# Altium schematic sheet COMS0006_SwC_Flow_Diagram.SchDoc: Switching Circuit Signal Flow
size A3; Engineer: D. JEDRYCHOWSKI; Organization: BLUEsat Project; Address1: Room 419; Address2: School of EE&T; Address3: UNSW, NSW 2052; Address4: Australia; DocumentNumber: COMS0006; SheetNumber: 1; SheetTotal: 1; Version: 1.0
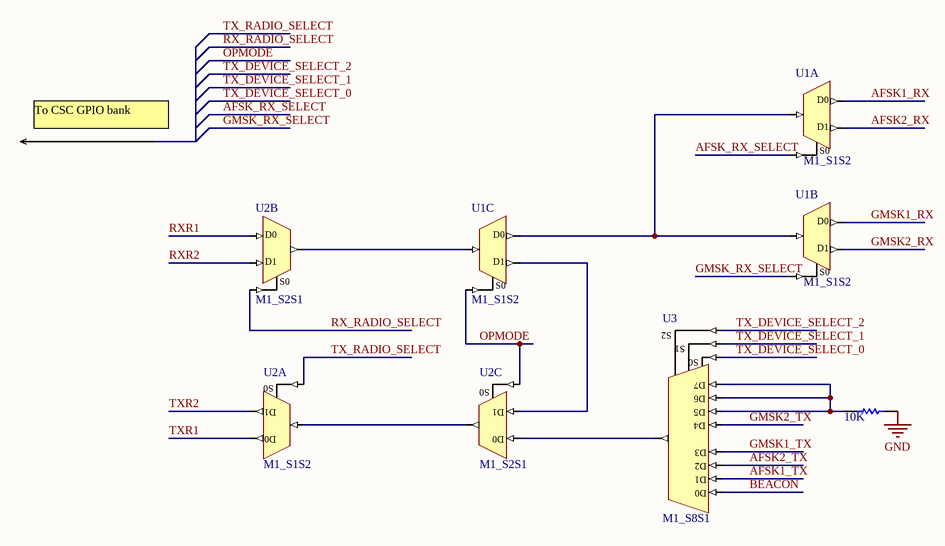
[diagram p0: COMS0006_SwC_Flow_Diagram.SchDoc]

## Parts
R?  value 10K  [AXIAL-0.3]  (hidden comment: Res1)
U1A  M1_S1S2
U1B  M1_S1S2
U1C  M1_S1S2
U2A  M1_S1S2
U2B  M1_S2S1
U2C  M1_S2S1
U3  M1_S8S1

## Nets
GND: R?.2
AFSK1_RX: U1A.D0
AFSK1_TX: U3.D1
AFSK2_RX: U1A.D1
AFSK2_TX: U3.D2
AFSK_RX_SELECT: U1A.S0
BEACON: U3.D0
GMSK1_RX: U1B.D0
GMSK1_TX: U3.D3
GMSK2_RX: U1B.D1
GMSK2_TX: U3.D4
GMSK_RX_SELECT: U1B.S0
OPMODE: U1C.S0 U2C.S0
RX_RADIO_SELECT: U2B.S0
RXR1: U2B.D0
RXR2: U2B.D1
TX_DEVICE_SELECT_0: U3.S0
TX_DEVICE_SELECT_1: U3.S1
TX_DEVICE_SELECT_2: U3.S2
TX_RADIO_SELECT: U2A.S0
TXR1: U2A.D0
TXR2: U2A.D1
NetR?_1: R?.1 U3.D5 U3.D6 U3.D7
NetU1A_O: U1A.O U1B.O U1C.D0
NetU1C_D1: U1C.D1 U2C.D1
NetU1C_O: U1C.O U2B.O
NetU2A_O: U2A.O U2C.O
NetU2C_D0: U2C.D0 U3.O

## Notes on the sheet
- To CSC GPIO bank
- Title
- Description:
- Size:
- Author:
- Date:
- A3
- Time:
- Version
- Sheet:
- Drawing No.:
- of
- File:

## Library data of the parts
R? = Res1: Resistor; Published: 8-Jun-2000; LatestRevisionDate: 17-Jul-2002; LatestRevisionNote: Re-released for DXP Platform.; PackageReference: AXIAL-0.3; Publisher: Altium Limited; PackageDescription: Axial Device, Thru-Hole; 2 Leads; 0.3 in Pin Spacing
U1A U1B U1C U2A = M1_S1S2: 1x1-Single Wire to 2x1-Single Wire Multiplexer (Demultiplex); SubClass: S1Sn; PortSize: 1; PortStyle: Single Pin Version; ArchiveName: GENERIC; VHDLIB_SIM: GENERIC_LIB; Published: 29-Jan-2004; Publisher: Altium Limited; LastRevisionNo: 1.00.00; HelpURL: CR0118 FPGA Generic Library Guide.pdf#page=328; ComponentLink1URL: CR0137 FPGA Multiplexer Resource Usage.pdf#page=36; ComponentLink1Description: Core &Resource Usage; FunctionalClass: Multiplexer
U2B U2C = M1_S2S1: 2x1-Single Wire to 1x1-Single Wire Multiplexer; XilinxEquivalent: M2_1; SubClass: SnS1; PortSize: 1; PortStyle: Single Pin Version; ArchiveName: GENERIC; VHDLIB_SIM: GENERIC_LIB; Published: 29-Jan-2004; Publisher: Altium Limited; LastRevisionNo: 1.00.00; HelpURL: CR0118 FPGA Generic Library Guide.pdf#page=364; ComponentLink1URL: CR0137 FPGA Multiplexer Resource Usage.pdf#page=50; ComponentLink1Description: Core &Resource Usage; FunctionalClass: Multiplexer
U3 = M1_S8S1: 8x1-Single Wire to 1x1-Single Wire Multiplexer; SubClass: SnS1; PortSize: 1; PortStyle: Single Pin Version; ArchiveName: GENERIC; VHDLIB_SIM: GENERIC_LIB; Published: 29-Jan-2004; Publisher: Altium Limited; LastRevisionNo: 1.00.00; HelpURL: CR0118 FPGA Generic Library Guide.pdf#page=379; ComponentLink1URL: CR0137 FPGA Multiplexer Resource Usage.pdf#page=56; ComponentLink1Description: Core &Resource Usage; FunctionalClass: Multiplexer